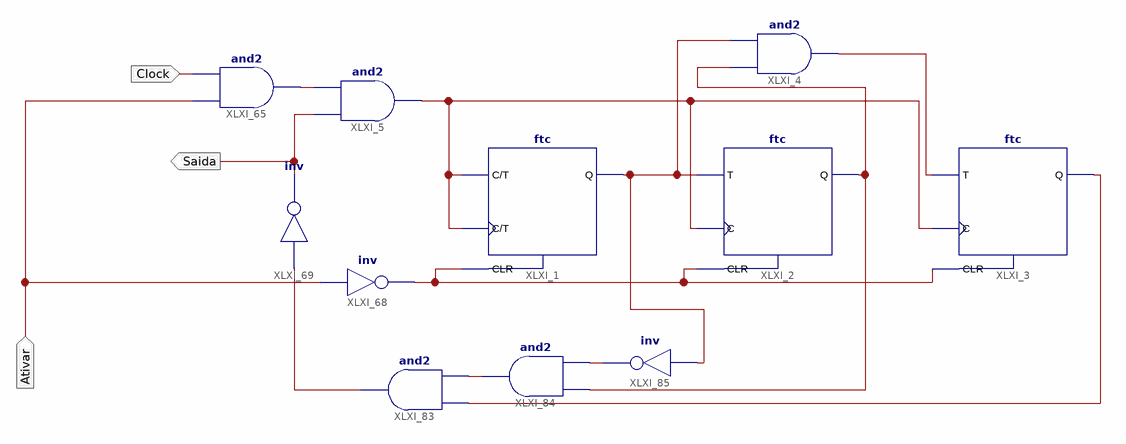
[diagram p0: schematic sheet 1]
// Xilinx ISE schematic ContadorTermobloco.sch (spartan6) as structural Verilog: 11 symbols, 3 ports
module ContadorTermobloco (
  input  Ativar,
  input  Clock,
  output Saida
);

  wire Q0, Q1, Q2, XLXN_1, XLXN_29, XLXN_39, XLXN_60, XLXN_61, XLXN_65, XLXN_83;

  ftc XLXI_1 (.C(XLXN_39), .CLR(XLXN_60), .T(XLXN_39), .Q(Q0));
  ftc XLXI_2 (.C(XLXN_39), .CLR(XLXN_60), .T(Q0), .Q(Q1));
  ftc XLXI_3 (.C(XLXN_39), .CLR(XLXN_60), .T(XLXN_1), .Q(Q2));
  and XLXI_4 (XLXN_1, Q1, Q0);
  and XLXI_5 (XLXN_39, Saida, XLXN_61);
  and XLXI_65 (XLXN_61, Ativar, Clock);
  not XLXI_68 (XLXN_60, Ativar);
  not XLXI_69 (Saida, XLXN_65);
  and XLXI_83 (XLXN_65, XLXN_29, Q2);
  and XLXI_84 (XLXN_29, XLXN_83, Q1);
  not XLXI_85 (XLXN_83, Q0);
endmodule
